# EAGLE design PPGMeter_M2 (EAGLE 9.5.2)
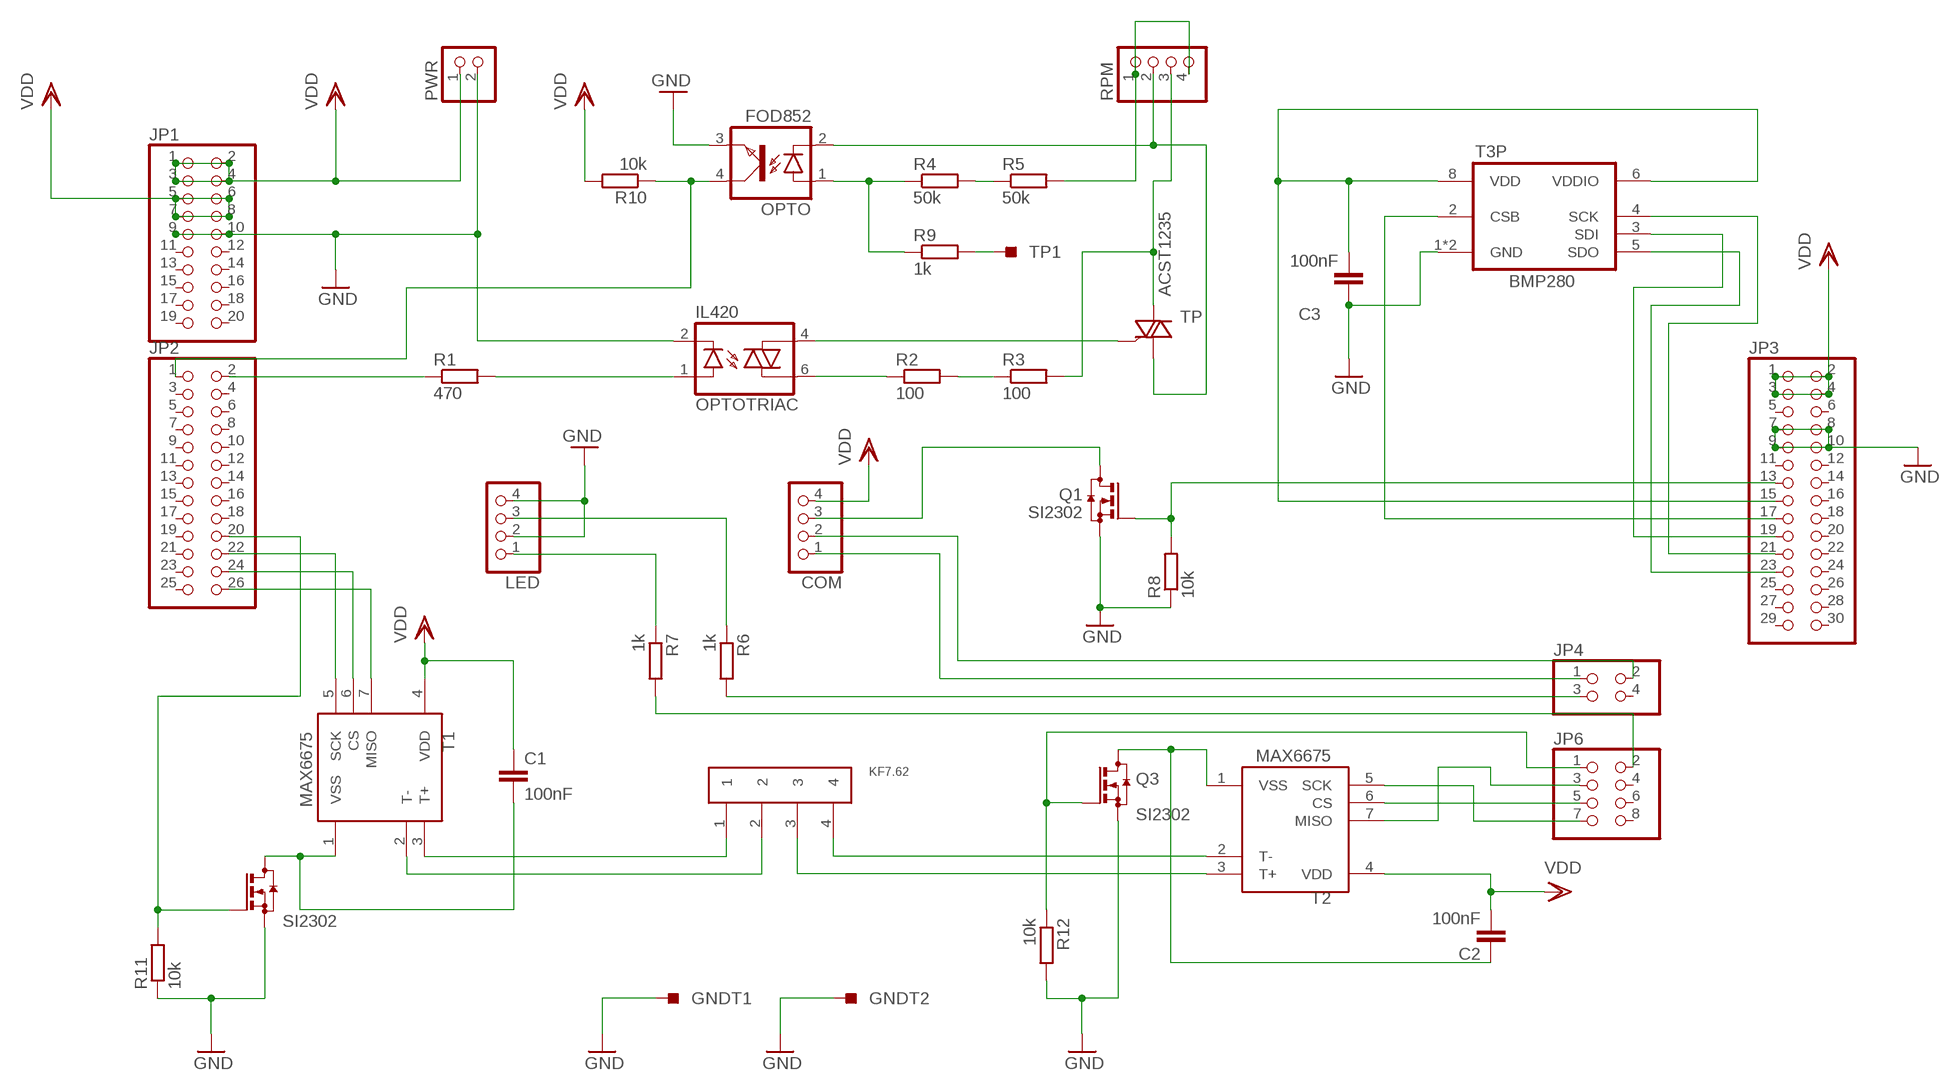
[diagram p0: schematic, sheet 1]

## Parts
C1  100nF  C-EUC0805K  [C0805K]
C2  100nF  C-EUC0805K  [C0805K]
C3  100nF  C-EUC0805K  [C0805K]
COM  PINHD-1X4/90  [1X04/90]
GNDT1  TPS-SMD-10X25N  [SMD-10X25SN]
GNDT2  TPS-SMD-10X25N  [SMD-10X25SN]
IO1  KF7.62  KF7.62KF7.62  [KF7.62]
JP1  PINHD-2X10  [2X10]
JP2  PINHD-2X13  [2X13]
JP3  PINHD-2X15  [2X15]
JP4  PINHD-2X2  [2X02]
JP6  PINHD-2X4  [2X04]
LED  PINHD-1X4/90  [1X04/90]
OPTO  FOD852  FOD852*  [SMD4]
OPTOTRIAC  IL420  [DIL06]
PWR  PINHD-1X2/90  [1X02/90]
Q1  SI2302  [SOT23]
Q2  SI2302  [SOT23]
Q3  SI2302  [SOT23]
R1  470  R-EU_R0805  [R0805]
R2  100  R-EU_R0805  [R0805]
R3  100  R-EU_R0805  [R0805]
R4  50k  R-EU_R0805  [R0805]
R5  50k  R-EU_R0805  [R0805]
R6  1k  R-EU_R0805  [R0805]
R7  1k  R-EU_R0805  [R0805]
R8  10k  R-EU_R0805  [R0805]
R9  1k  R-EU_R0805  [R0805]
R10  10k  R-EU_R0805  [R0805]
R11  10k  R-EU_R0805  [R0805]
R12  10k  R-EU_R0805  [R0805]
RPM  PINHD-1X4/90  [1X04/90]
T1  MAX6675  [SO08]
T2  MAX6675  [SO08]
T3P  BMP280  [BMP280]
TP  ACST1235  [TO220AB]
TP1  TPS-SMD-10X25N  [SMD-10X25SN]

## Nets
GND: C3.1 GNDT1.TP GNDT2.TP JP1.9 JP1.10 JP3.7 JP3.8 JP3.9 JP3.10 LED.2 LED.4 OPTO.3(EMIT) OPTOTRIAC.2(C) PWR.2 Q1.2(S) Q2.2(S) Q3.2(S) R8.1 R11.1 R12.2 T3P.1(GND) T3P.7(GND)
LED1: LED.1 R7.1
LED2: LED.3 R6.1
N$1: JP2.26 T1.7(MISO)
N$2: R9.2 TP1.TP
N$3: JP2.2 R1.1
N$4: JP6.2 R7.2
N$5: OPTOTRIAC.1(A) R1.2
N$6: OPTOTRIAC.4(A1) TP.3(G)
N$7: R2.2 R3.1
N$8: R3.2 RPM.3 TP.2(A2)
N$9: C1.2 Q2.3(D) T1.1(VSS)
N$10: OPTO.1(A) R4.1 R9.1
N$11: R4.2 R5.1
N$12: JP3.13 Q1.1(G) R8.2
N$13: JP2.1 OPTO.4(COL) R10.1
N$14: JP2.24 T1.6(CS)
N$15: JP2.22 T1.5(SCK)
N$16: JP6.7 T2.5(SCK)
N$17: JP6.3 T2.7(MISO)
N$18: OPTOTRIAC.6(A2) R2.1
N$19: JP4.3 R6.2
N$20: JP2.20 Q2.1(G) R11.2
N$21: JP6.5 T2.6(CS)
N$22: R5.2 RPM.1 RPM.4
N$23: C3.2 JP3.15 T3P.6(VDDIO) T3P.8(VDD)
N$24: JP3.21 T3P.4(SCK)
N$25: JP3.23 T3P.5(SDO)
N$26: COM.3 Q1.3(D)
N$27: JP3.17 T3P.2(CSB)
N$28: JP3.19 T3P.3(SDI)
N$29: IO1.1 T1.3(T+)
N$30: OPTO.2(C) RPM.2 TP.1(A1)
N$31: IO1.2 T1.2(T-)
N$32: C2.1 Q3.3(D) T2.1(VSS)
N$33: IO1.3 T2.3(T+)
N$34: JP6.1 Q3.1(G) R12.1
N$35: IO1.4 T2.2(T-)
RX: COM.1 JP4.1
TX: COM.2 JP4.2
VDD3.3: JP1.5 JP1.6 JP1.7 JP1.8 R10.2 ; supply symbol labelled VDD
VDD5: COM.4 JP1.1 JP1.2 JP1.3 JP1.4 PWR.1 ; supply symbol labelled VDD
VDD33: C1.1 C2.2 JP3.1 JP3.2 JP3.3 JP3.4 T1.4(VDD) T2.4(VDD) ; supply symbol labelled VDD
Unconnected: JP1.11 JP1.12 JP1.13 JP1.14 JP1.15 JP1.16 JP1.17 JP1.18 JP1.19 JP1.20 JP2.3 JP2.4 JP2.5 JP2.6 JP2.7 JP2.8 JP2.9 JP2.10 JP2.11 JP2.12 JP2.13 JP2.14 JP2.15 JP2.16 JP2.17 JP2.18 JP2.19 JP2.21 JP2.23 JP2.25 JP3.5 JP3.6 JP3.11 JP3.12 JP3.14 JP3.16 JP3.18 JP3.20 JP3.22 JP3.24 JP3.25 JP3.26 JP3.27 JP3.28 JP3.29 JP3.30 JP4.4 JP6.4 JP6.6 JP6.8

## Library data of the parts
C1-C3 = rcl:C-EU: CAPACITOR, European symbol; SPICEPREFIX: C
COM LED RPM = pinhead:PINHD-1X4: PIN HEADER
GNDT1 GNDT2 TP1 = TEST:TPS: TEST POINT PAD; BOM: EXCLUDE
IO1 = ppgmeter:KF7.62: Conector 4P
JP1 = pinhead:PINHD-2X10: PIN HEADER
JP2 = pinhead:PINHD-2X13: PIN HEADER
JP3 = pinhead:PINHD-2X15: PIN HEADER
JP4 = pinhead:PINHD-2X2: PIN HEADER
JP6 = pinhead:PINHD-2X4: PIN HEADER
OPTO = ppgmeter:FOD852: Fairchild OPTO COUPLER; LCSC: C258252
OPTOTRIAC = optocoupler:IL420: SIEMENS OPTO COUPLER; MF: VISHAY/TELEFUNKEN; MPN: IL420; OC_FARNELL: 1469561; OC_NEWARK: 58K1719
PWR = pinhead:PINHD-1X2: PIN HEADER
Q1-Q3 = ppgmeter:SI2302: N-CHANNEL MOS FET; LCSC: C77977; SPICEPREFIX: Q
R1-R12 = rcl:R-EU_: RESISTOR, European symbol; SPICEPREFIX: R
T1 T2 = ppgmeter:MAX6675: Type-K Thermocouple; LCSC: C16030
T3P = ppgmeter:BMP280: Gas sensor; LCSC: C83291
TP = ppgmeter:ACST1235: Triac ACST1235 Overvoltage protected AC switch

## Board
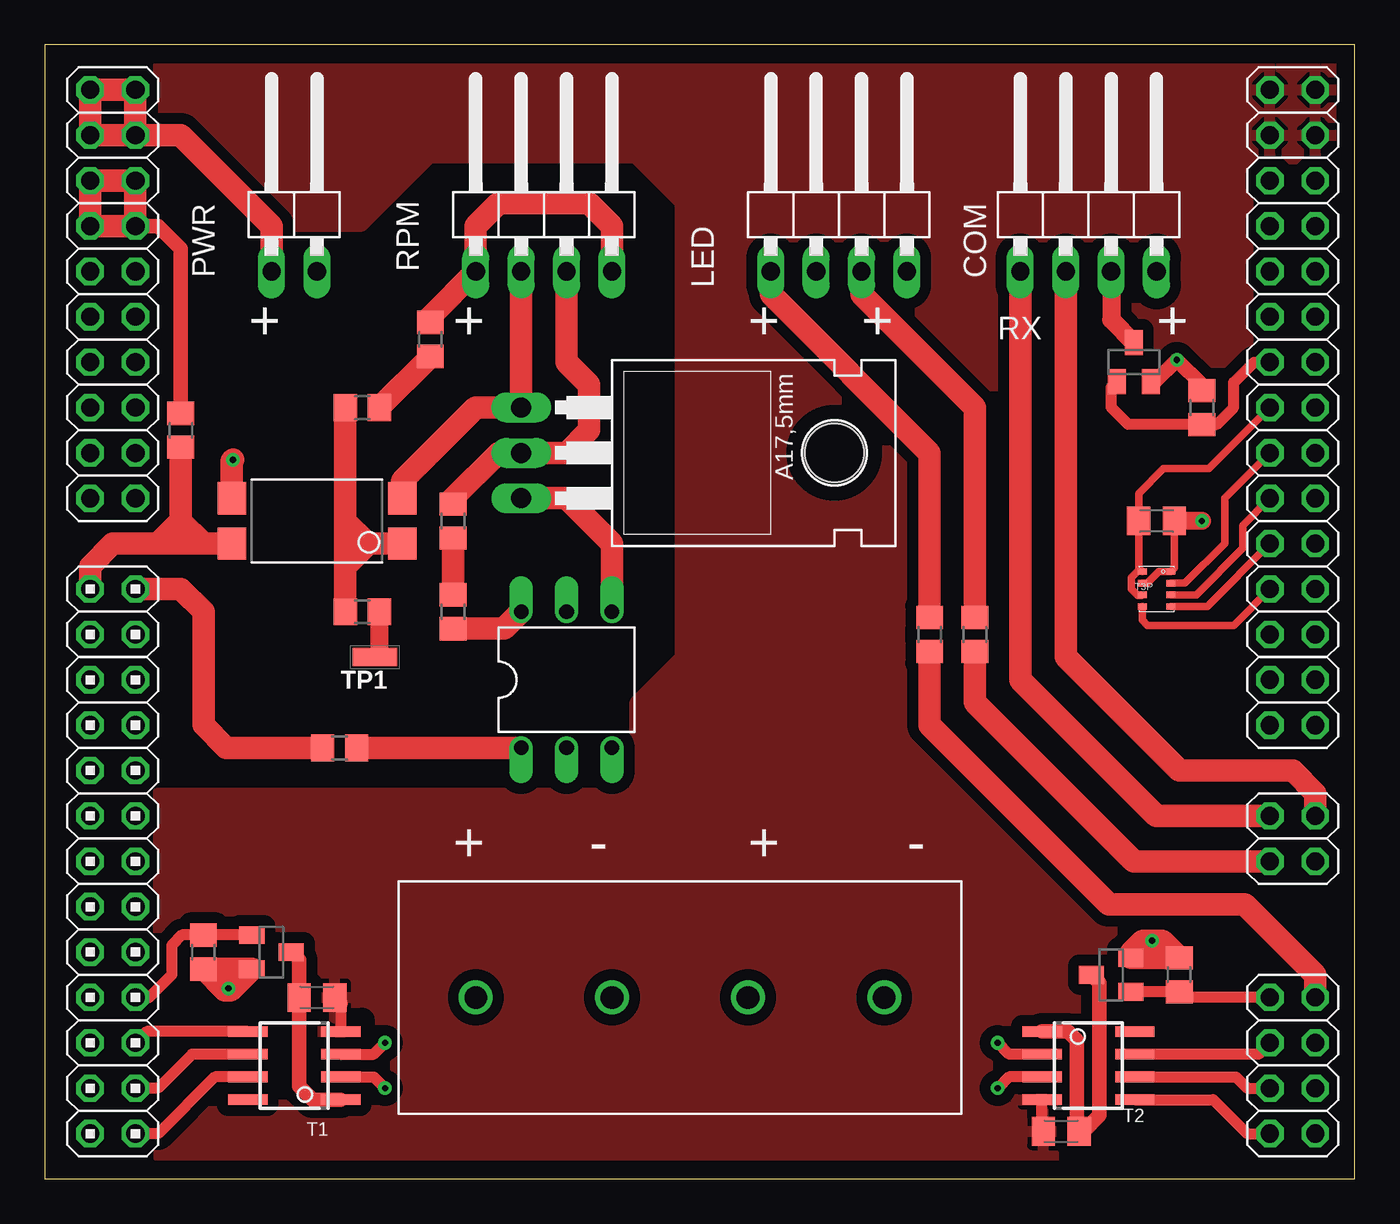
[diagram p1: board, top side]
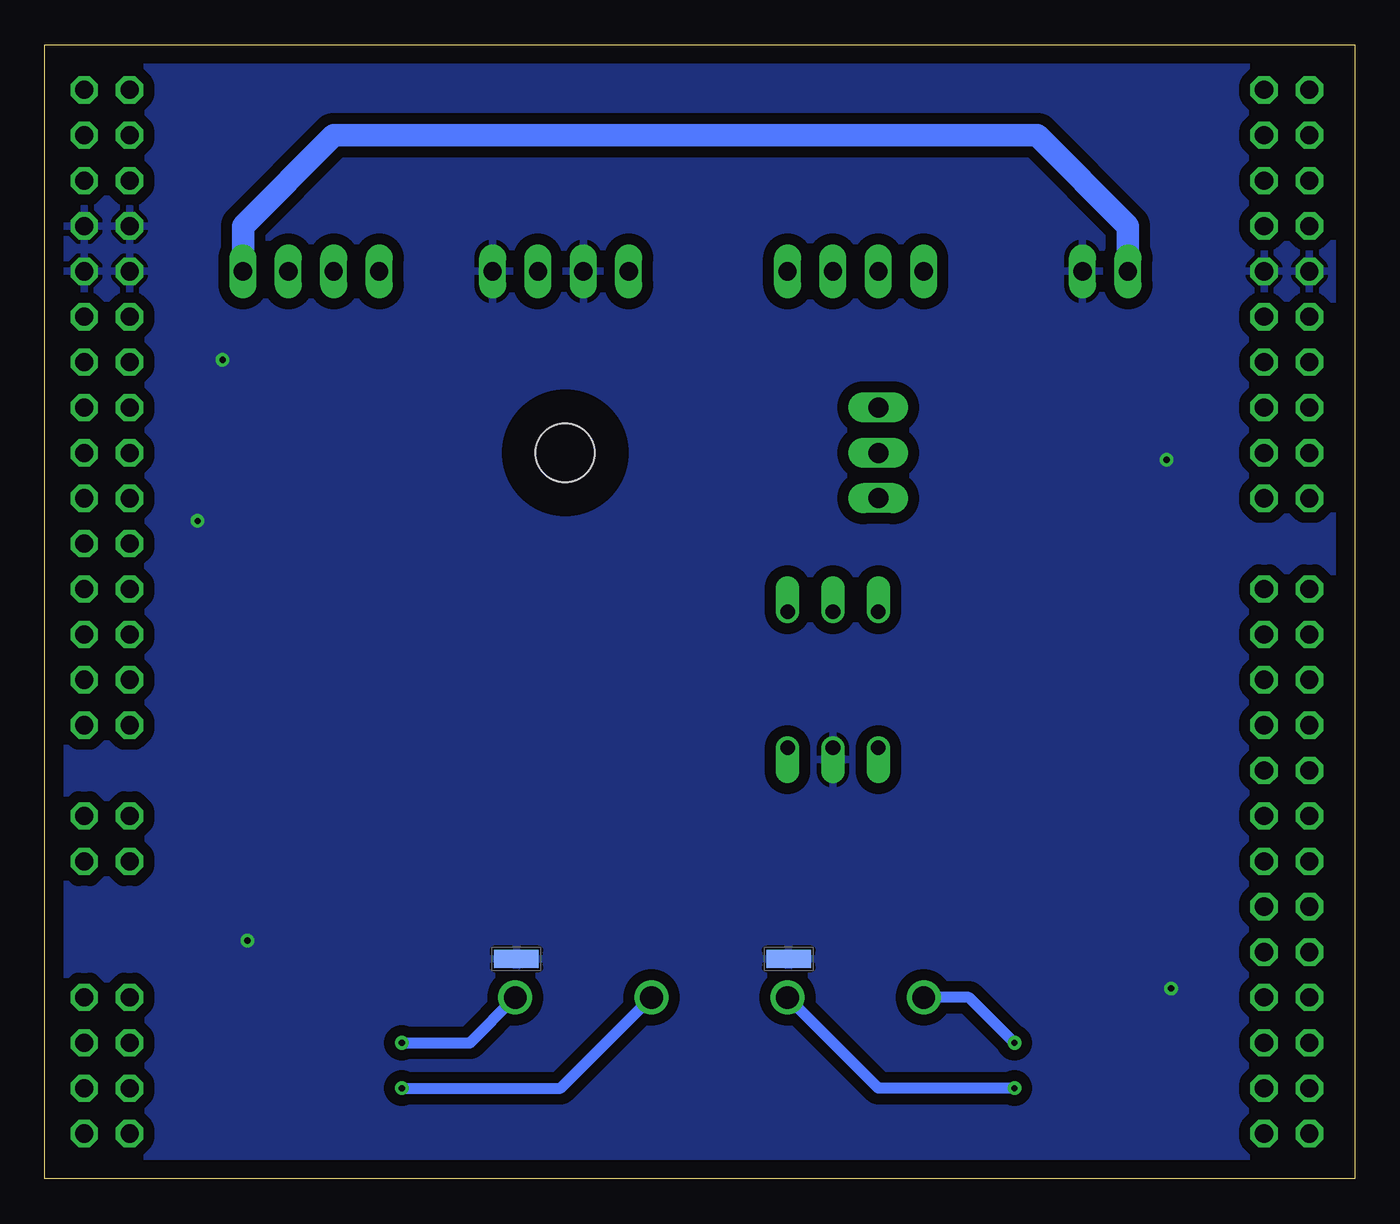
[diagram p2: board, bottom side, seen from below]

Size 73.33 x 63.49 mm. Coordinates in mm from the lower left corner, seen from the top.
Outline: 0,0 73.33,0 73.33,63.49 0,63.49 0,0
Copper layers (1*16): Top 0.035mm / dielectric 1.5mm / Bottom 0.035mm
Design rules "default": minimum track width 6mil, minimum drill 0.35mm, track to track 6mil, track to pad 6mil, pad to pad 6mil, via to via 6mil, smd to smd 6mil, copper to edge 40mil, drill to drill 6mil, minimum pad ring 10mil, minimum via ring 8mil, stop-mask expansion 4mil, vias tented up to drill 0mil, thermal gap 10mil
tRestrict: 1 lines

### Footprints (pad centres in the part's own frame; a part is rotated, then mirrored left to right if it is on the bottom)
C0805K = smd 1.3 x 1.6: 1 -1,0; 2 1,0
1X04/90 = drill 1.016 long: 1 -3.81,-3.81; 2 -1.27,-3.81; 3 1.27,-3.81; 4 3.81,-3.81
SMD-10X25SN = smd 1 x 2.5: TP 0,-0.7
KF7.62 = drill 1.27: 1 -11.43,0; 2 -3.81,0; 3 3.81,0; 4 11.43,0
2X10 = drill 1.016 octagon: 1 -11.43,-1.27; 2 -11.43,1.27; 3 -8.89,-1.27; 4 -8.89,1.27; 5 -6.35,-1.27; 6 -6.35,1.27; 7 -3.81,-1.27; 8 -3.81,1.27; 9 -1.27,-1.27; 10 -1.27,1.27; 11 1.27,-1.27; 12 1.27,1.27; 13 3.81,-1.27; 14 3.81,1.27; 15 6.35,-1.27; 16 6.35,1.27; 17 8.89,-1.27; 18 8.89,1.27; 19 11.43,-1.27; 20 11.43,1.27
2X13 = drill 1.016 octagon: 1 -15.24,-1.27; 2 -15.24,1.27; 3 -12.7,-1.27; 4 -12.7,1.27; 5 -10.16,-1.27; 6 -10.16,1.27; 7 -7.62,-1.27; 8 -7.62,1.27; 9 -5.08,-1.27; 10 -5.08,1.27; 11 -2.54,-1.27; 12 -2.54,1.27; 13 0,-1.27; 14 0,1.27; 15 2.54,-1.27; 16 2.54,1.27; 17 5.08,-1.27; 18 5.08,1.27; 19 7.62,-1.27; 20 7.62,1.27; 21 10.16,-1.27; 22 10.16,1.27; 23 12.7,-1.27; 24 12.7,1.27; 25 15.24,-1.27; 26 15.24,1.27
2X15 = drill 1.016 octagon: 1 -17.78,-1.27; 2 -17.78,1.27; 3 -15.24,-1.27; 4 -15.24,1.27; 5 -12.7,-1.27; 6 -12.7,1.27; 7 -10.16,-1.27; 8 -10.16,1.27; 9 -7.62,-1.27; 10 -7.62,1.27; 11 -5.08,-1.27; 12 -5.08,1.27; 13 -2.54,-1.27; 14 -2.54,1.27; 15 0,-1.27; 16 0,1.27; 17 2.54,-1.27; 18 2.54,1.27; 19 5.08,-1.27; 20 5.08,1.27; 21 7.62,-1.27; 22 7.62,1.27; 23 10.16,-1.27; 24 10.16,1.27; 25 12.7,-1.27; 26 12.7,1.27; 27 15.24,-1.27; 28 15.24,1.27; 29 17.78,-1.27; 30 17.78,1.27
2X02 = drill 1.016 octagon: 1 -1.27,-1.27; 2 -1.27,1.27; 3 1.27,-1.27; 4 1.27,1.27
2X04 = drill 1.016 octagon: 1 -3.81,-1.27; 2 -3.81,1.27; 3 -1.27,-1.27; 4 -1.27,1.27; 5 1.27,-1.27; 6 1.27,1.27; 7 3.81,-1.27; 8 3.81,1.27
SMD4 = smd 1.6 x 1.8: 1 -4.77,1.27; 2 -4.77,-1.27; 3 4.77,-1.27; 4 4.77,1.27
DIL06 = drill 0.813 offset: 1 -2.54,-3.81; 2 0,-3.81; 3 2.54,-3.81; 4 2.54,3.81; 5 0,3.81; 6 -2.54,3.81
1X02/90 = drill 1.016 long: 1 -1.27,-3.81; 2 1.27,-3.81
SOT23 = smd 1.4 x 1: 1 1.1,-0.95; 2 1.1,0.95; 3 -1.1,0
R0805 = smd 1.3 x 1.5: 1 -0.95,0; 2 0.95,0
SO08 = smd 0.6 x 2.2: 1 -1.905,-2.6; 2 -0.635,-2.6; 3 0.635,-2.6; 4 1.905,-2.6; 5 1.905,2.6; 6 0.635,2.6; 7 -0.635,2.6; 8 -1.905,2.6
BMP280 = smd 0.5 x 0.35: 1 0.8,0.975; 2 0.8,0.325; 3 0.8,-0.325; 4 0.8,-0.975; 5 -0.8,-0.975; 6 -0.8,-0.325; 7 -0.8,0.325; 8 -0.8,0.975
TO220AB = drill 1.118 long: 1 -2.54,-6.35; 2 0,-6.35; 3 2.54,-6.35 | hole 3.302: 0,11.176

### Placement (x,y rotation side)
C1  15.24,10.16 180 top
C2  56.9,2.67 180 top
C3  62.23,36.83 180 top
COM  58.42,54.61 0 top
GNDT1  30.99,12.32 270 bottom
GNDT2  47.62,12.32 90 bottom
IO1  35.56,10.16 0 top
JP1  3.81,49.53 270 top
JP2  3.81,17.78 270 top
JP3  69.85,43.18 270 top
JP4  69.85,19.05 270 top
JP6  69.85,6.35 270 top
LED  44.45,54.61 0 top
OPTO  15.24,36.83 180 top
OPTOTRIAC  29.21,27.94 0 top
PWR  13.97,54.61 0 top
Q1  60.96,45.72 270 top
Q2  12.7,12.7 180 top
Q3  59.69,11.43 0 top
R1  16.51,24.13 0 top
R2  22.86,31.75 90 top
R3  22.86,36.83 90 top
R4  17.78,43.18 0 top
R5  21.59,46.99 90 top
R6  52.07,30.48 270 top
R7  49.53,30.48 270 top
R8  64.77,43.18 270 top
R9  17.78,31.75 0 top
R10  7.62,41.91 90 top
R11  8.89,12.7 90 top
R12  63.5,11.43 90 top
RPM  27.94,54.61 0 top
T1  13.97,6.35 90 top
T2  58.42,6.35 270 top
T3P  62.23,33.02 0 top
TP  33.02,40.64 270 top
TP1  17.78,29.21 90 top

### Tracks (layer width: path | path; a pad name or v marks a point on that pad's centre or on a via)
GND  (via drill 0.35)
  Top 0.406: C3.1 63.23,34.2 T3P.1 62.36,33.99 61.71,33.34 T3P.7
  Top 0.813: Q1.2 62.15,44.62 v63.37,45.85 64.77,44.45 R8.1
  Top 1.016: v64.77,36.83 C3.1
  Top 1.27: OPTO.3 10.47,40.19 v10.54,40.26 | 10.29,10.56 v10.29,10.67 | 10.29,10.56 10.08,10.56 R11.1 Q2.2 10.41,10.56 10.29,10.56 | Q3.2 60.79,12.66 61.47,13.33 v61.98,13.33 62.54,13.33 R12.2 Q3.2
  pour Bottom (isolate 0.61): 1.27,62.23 72.39,62.23 72.39,1.27 1.27,1.27
LED1
  Top 1.27: LED.1 40.64,49.53 49.53,40.64 R7.1
LED2
  Top 1.27: LED.3 45.72,49.53 52.07,43.18 R6.1
N$1
  Top 0.61: T1.7 9.52,5.71 6.35,2.54 JP2.26
N$2
  Top 1.016: R9.2 18.73,29.46 TP1.TP
N$3
  Top 1.27: R1.1 10.16,24.13 8.89,25.4 8.89,31.75 7.62,33.02 JP2.2
N$4
  Top 1.27: JP6.2 71.12,11.43 67.18,15.37 59.56,15.37 49.53,25.4 R7.2
N$5
  Top 1.27: OPTOTRIAC.1 R1.2
N$6
  Top 1.27: TP.3 29.21,38.1 31.75,35.56 OPTOTRIAC.4
N$7
  Top 1.27: R3.1 R2.2
N$8
  Top 1.27: R3.2 22.86,38.1 25.4,40.64 TP.2 29.21,40.64 30.48,41.91 30.48,44.45 29.21,45.72 RPM.3
N$9
  Top 0.61: Q2.3 14.24,12.26
  Top 0.813: 14.24,12.26 C1.2 14.24,5.19 14.99,4.45 T1.1
N$10
  Top 1.27: R4.1 16.83,36.83 | 16.83,36.83 16.83,34.29 | 16.83,34.29 R9.1 | 18.1,35.56 16.83,36.83 | OPTO.1 18.1,35.56 | 18.1,35.56 16.83,34.29
N$11
  Top 1.27: R5.1 R4.2
N$12
  Top 0.61: Q1.1 59.69,44.3 59.69,43.18 60.64,42.23 R8.2 65.6,42.23 66.55,43.18 66.55,44.58 67.69,45.72 JP3.13
N$13
  Top 1.27: OPTO.4 8.89,35.56 | 8.89,35.56 6.35,35.56 | 6.35,35.56 3.81,35.56 2.54,34.29 JP2.1 | 7.62,36.83 6.35,35.56 | R10.1 7.62,36.83 | 7.62,36.83 8.89,35.56
N$14
  Top 0.61: T1.6 8.25,6.99 6.35,5.08 JP2.24
N$15
  Top 0.61: T1.5 5.71,8.26 JP2.22
N$16
  Top 0.61: T2.5 65.41,4.45 67.31,2.54 JP6.7
N$17
  Top 0.61: JP6.3 67.94,6.99 T2.7
N$18
  Top 1.27: R2.1 25.72,30.8 OPTOTRIAC.6
N$19
  Top 1.27: R6.2 52.07,26.67 60.96,17.78 JP4.3
N$20
  Top 0.61: Q2.1 R11.2 7.68,13.65 7.11,13.08 7.11,11.43 5.84,10.16 JP2.20
N$21
  Top 0.61: T2.6 66.68,5.71 67.31,5.08 JP6.5
N$22
  Top 1.27: R5.2 21.59,48.26 RPM.1 24.13,53.34 25.4,54.61 30.48,54.61 31.75,53.34 RPM.4
N$23
  Top 0.406: JP3.15 65.15,39.75 62.61,39.75 61.23,38.37 C3.2 61.23,34.2 T3P.8 61.39,34.03 61.19,34.03 60.82,33.67 60.82,33.02 61.19,32.66 61.39,32.66 T3P.6
N$24
  Top 0.406: T3P.4 65.06,32.05 JP3.21
N$25
  Top 0.406: T3P.5 61.43,31.28 61.72,30.99 66.55,30.99 JP3.23
N$26
  Top 1.016: COM.3 59.69,48.09 Q1.3
N$27
  Top 0.406: T3P.2 63.82,33.34 66.04,35.56 66.04,38.1 JP3.17
N$28
  Top 0.406: T3P.3 64.44,32.7 67.06,35.31 67.06,36.58 JP3.19
N$29  (via drill 0.35)
  Top 0.61: T1.3 18.41,6.99 v19.05,7.62
  Bottom 0.61: v19.05,7.62 21.59,10.16 IO1.1
N$30
  Top 1.27: RPM.2 TP.1 24.13,43.18 20.01,39.06 OPTO.2
N$31  (via drill 0.35)
  Top 0.61: T1.2 18.41,5.71 v19.05,5.08
  Bottom 0.61: v19.05,5.08 26.67,5.08 IO1.2
N$32
  Top 0.61: 58.15,2.67 C2.1 57.76,2.8
  Top 0.813: Q3.3 59.04,10.98 59.04,3.56 58.15,2.67 | T2.1 57.28,8.26 57.76,7.77 57.76,2.8
N$33  (via drill 0.35)
  Top 0.61: T2.3 53.98,5.71 v53.34,5.08
  Bottom 0.61: v53.34,5.08 44.45,5.08 IO1.3
N$34
  Top 0.61: Q3.1 R12.1 63.82,10.16 JP6.1
N$35  (via drill 0.35)
  Top 0.61: T2.2 53.98,6.99 v53.34,7.62
  Bottom 0.61: v53.34,7.62 49.53,7.62 IO1.4
RX
  Top 1.27: JP4.1 62.23,20.32 54.61,27.94 COM.1
TX
  Top 1.27: JP4.2 71.12,21.59 69.85,22.86 63.5,22.86 57.15,29.21 COM.2
VDD3.3
  Top 0.813: 3.81,53.34 6.35,53.34 7.62,52.07 R10.2
  Top 1.27: JP1.6 JP1.5 JP1.7 3.81,53.34 JP1.8 JP1.6
VDD5
  Top 1.27: PWR.1 12.7,53.34 7.62,58.42 JP1.4 | JP1.4 JP1.2 JP1.1 JP1.3 JP1.4
  Bottom 1.27: PWR.1 12.7,53.34 17.78,58.42 57.15,58.42 62.23,53.34 COM.4
VDD33
  Top 0.61: 16.57,9.83 T1.4 | C2.2 55.82,2.74 T2.4
  Top 0.813: C1.1 16.57,9.83
  pour Top (isolate 0.61): 6.35,62.23 6.35,59.69 12.7,53.34 17.78,53.34 21.59,57.15 33.02,57.15 35.56,54.61 35.56,29.21 33.02,26.67 33.02,21.59 6.35,21.59 6.35,1.27 72.39,1.27 72.39,62.23

### Text on the board
tPlace: RX
tNames: + | + | + | + | + | + | - | + | -